# EAGLE design breakout mcp2200 (EAGLE 5.10)
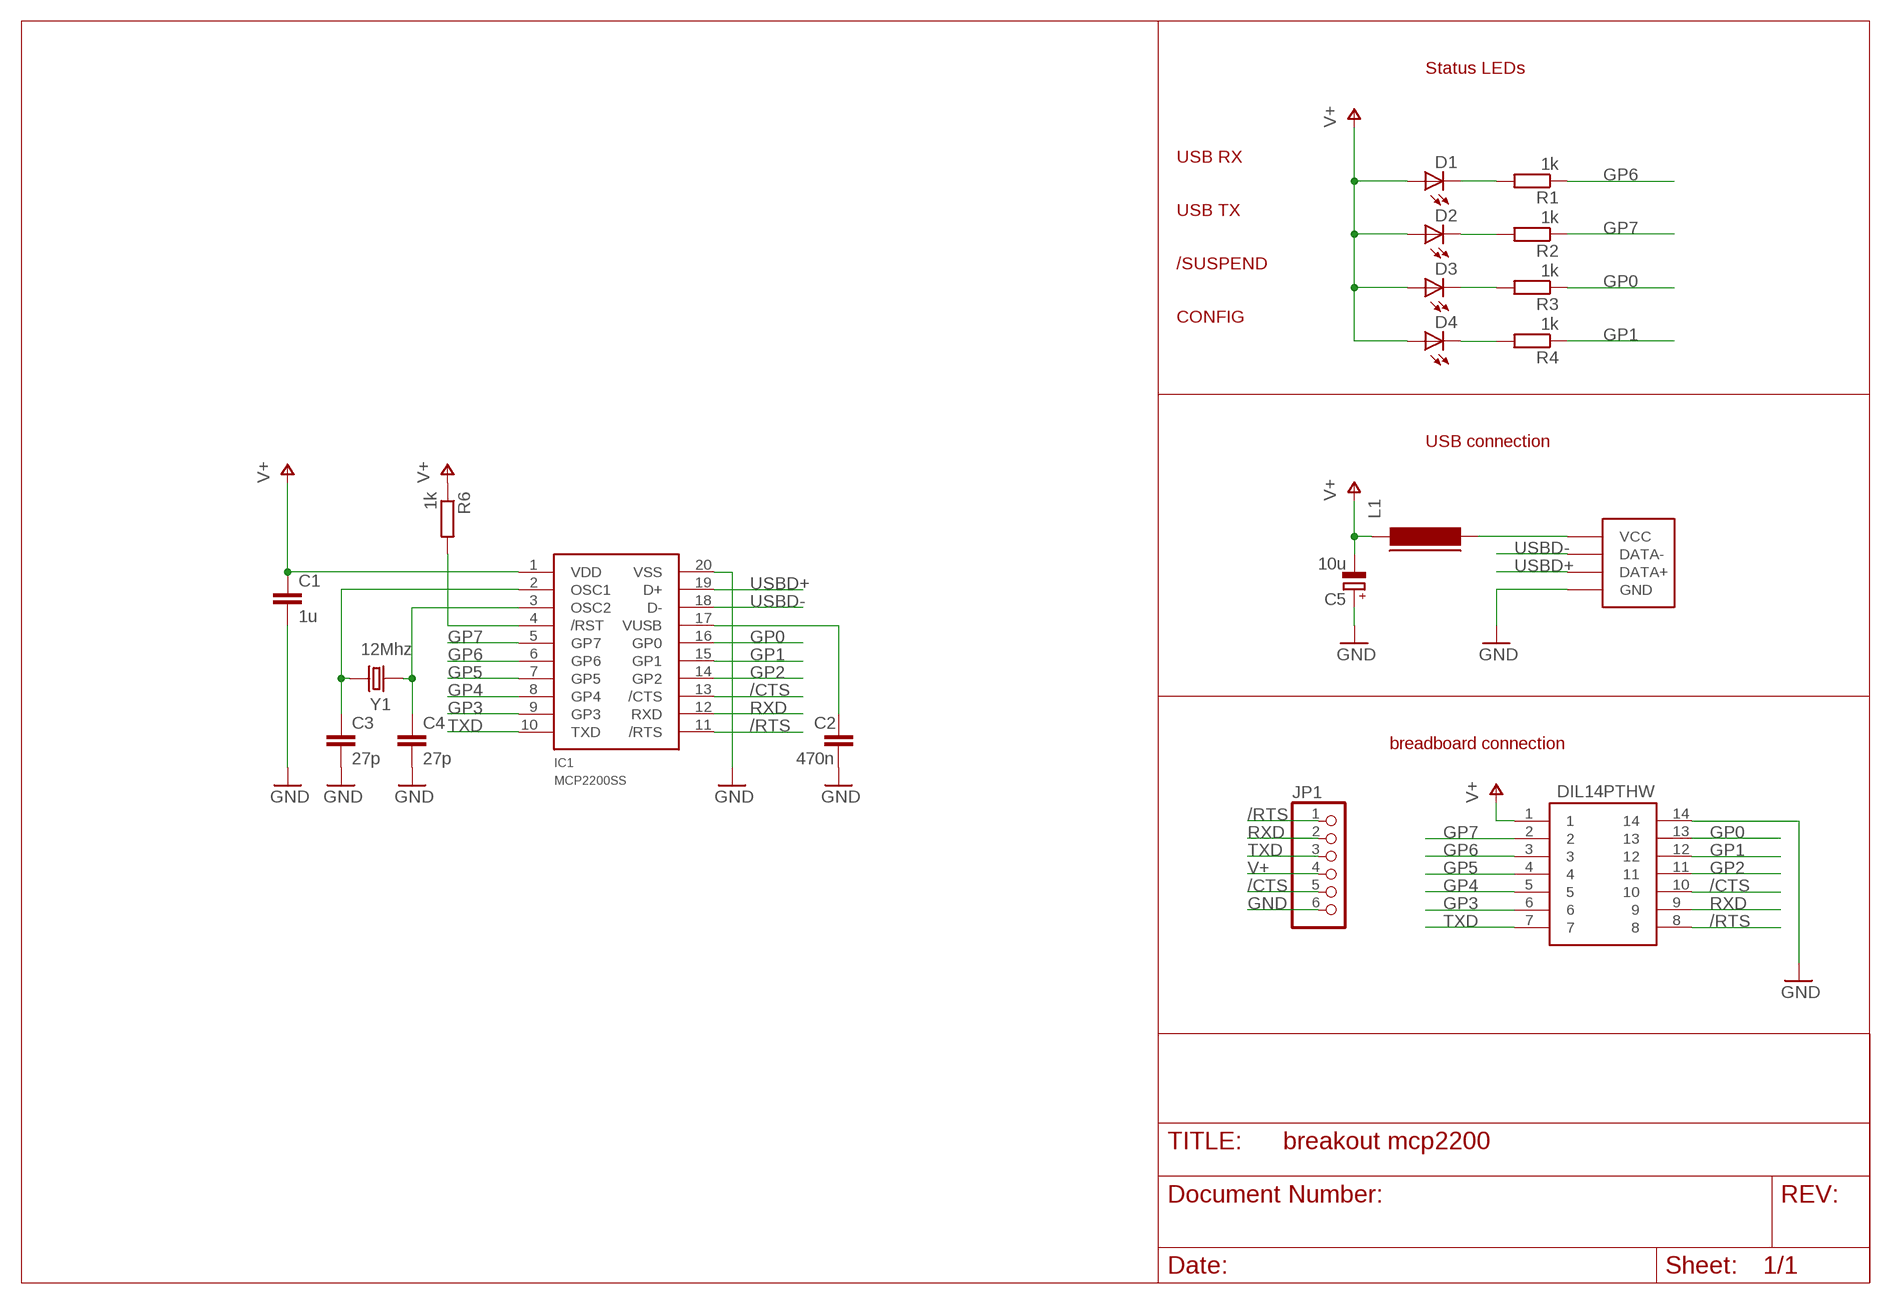
[diagram p0: schematic, sheet 1]

## Parts
C1  1u  CAPC805  [C805]
C2  470n  CAPC805  [C805]
C3  27p  CAPC805  [C805]
C4  27p  CAPC805  [C805]
C5  10u  CAP_POLSMC_A  [SMC_A]
D1  LED805  [LED-805]
D2  LED805  [LED-805]
D3  LED805  [LED-805]
D4  LED805  [LED-805]
IC1  MCP2200SS  [SSOP20]
JP1  PINHD-1X6  [1X06]
L1  FERRITE_BEAD805  [FB805]
R1  1k  RESISTORR805R805  [R805]
R2  1k  RESISTORR805R805  [R805]
R3  1k  RESISTORR805R805  [R805]
R4  1k  RESISTORR805R805  [R805]
R6  1k  RESISTORR805R805  [R805]
U$1  DIL14PTHW  [DIP14W]
X1  MINI-USBUSB2  [CONN_MINI_USB_B]
Y1  12Mhz  CRYSTAL_212M_  [4X6]

## Nets
/CTS: IC1.13(/CTS) JP1.5 U$1.10
/RTS: IC1.11(/RTS) JP1.1 U$1.8
GND: C1.2 C2.2 C3.2 C4.2 C5.+ IC1.20(VSS) JP1.6 U$1.14 X1.GND
GP0: IC1.16(GP0) R3.1 U$1.13
GP1: IC1.15(GP1) R4.1 U$1.12
GP2: IC1.14(GP2) U$1.11
GP3: IC1.9(GP3) U$1.6
GP4: IC1.8(GP4) U$1.5
GP5: IC1.7(GP5) U$1.4
GP6: IC1.6(GP6) R1.1 U$1.3
GP7: IC1.5(GP7) R2.1 U$1.2
N$1: D3.C R3.2
N$2: D1.C R1.2
N$3: D2.C R2.2
N$4: D4.C R4.2
N$5: L1.2 X1.VUSB(VCC)
N$18: C2.1 IC1.17(VUSB)
N$20: C3.1 IC1.2(OSC1) Y1.2(X2)
N$22: C4.1 IC1.3(OSC2) Y1.1(X1)
N$23: IC1.4(/RST) R6.2
RXD: IC1.12(RXD) JP1.2 U$1.9
TXD: IC1.10(TXD) JP1.3 U$1.7
USBD+: IC1.19(D+) X1.D+(DATA+)
USBD-: IC1.18(D-) X1.D-(DATA-)
V+: C1.1 C5.- D1.A D2.A D3.A D4.A IC1.1(VDD) JP1.4 L1.1 R6.1 U$1.1

## Notes on the sheet
- Status LEDs
- USB RX
- USB TX
- /SUSPEND
- CONFIG
- USB connection
- breadboard connection

## Library data of the parts
C1-C4 = dp_devices:CAP
C5 = dp_devices:CAP_POL
D1-D4 = dp_devices:LED
IC1 = dp_devices:MCP2200
JP1 = pinhead - Copy:PINHD-1X6: PIN HEADER
L1 = dp_devices:FERRITE_BEAD
R1-R4 R6 = dp_devices:RESISTOR
U$1 = dp_devices:DIL14
X1 = dp_devices:MINI-USB
Y1 = dp_devices:CRYSTAL_2

## Board
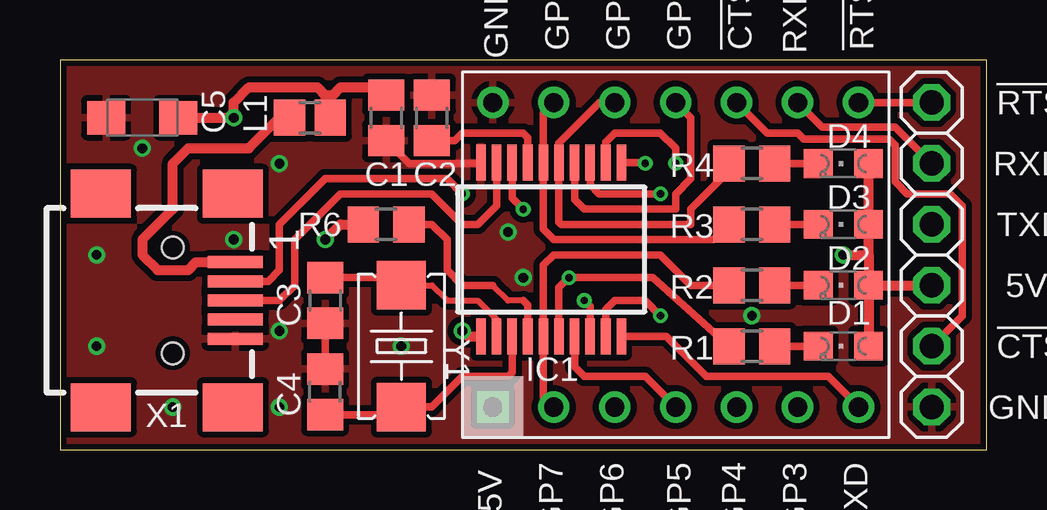
[diagram p1: board, top side]
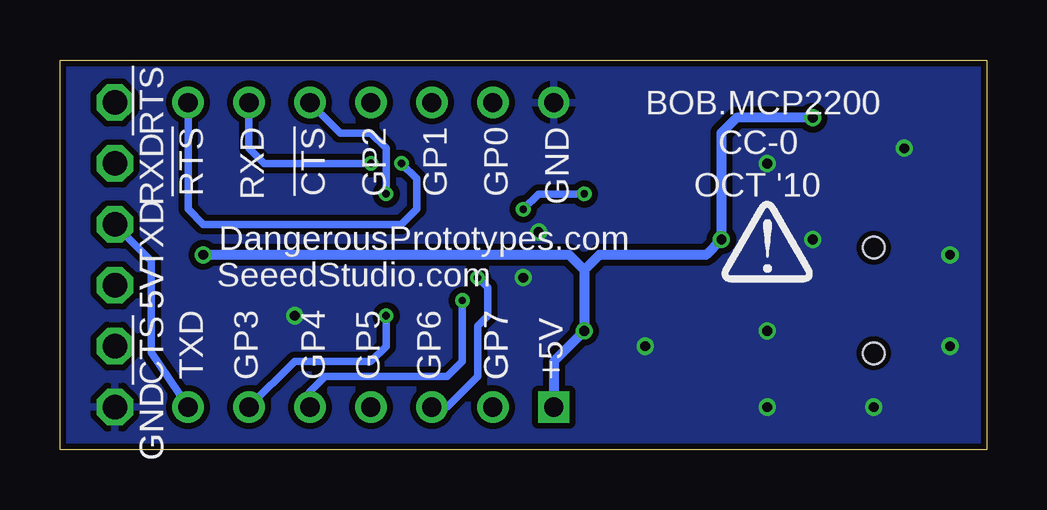
[diagram p2: board, bottom side, seen from below]

Size 38.61 x 16.26 mm. Coordinates in mm from the lower left corner, seen from the top.
Outline: 0,0 38.61,0 38.61,16.26 0,16.26 0,0
Copper layers (1*16): Top 0.035mm / dielectric 1.5mm / Bottom 0.035mm
Design rules "Fusion_eagle_rule_v1.1": minimum track width 6mil, minimum drill 12mil, track to track 6mil, track to pad 6mil, pad to pad 6mil, via to via 6mil, smd to smd 0mil, copper to edge 10mil, drill to drill 10mil, minimum pad ring 10mil, minimum via ring 6mil, stop-mask expansion 2mil, vias tented up to drill 100mil, thermal gap 10mil

### Footprints (pad centres in the part's own frame; a part is rotated, then mirrored left to right if it is on the bottom)
C805 = smd 1.3 x 1.5: 1 -0.95,0; 2 0.95,0
SMC_A = smd 1.6 x 1.4: + -1.5,0; - 1.5,0
LED-805 = smd 1.2 x 1.2: A 0,-1.05; C 0,1.05
SSOP20 = smd 0.4 x 1.5: 1 -2.925,-3.625; 2 -2.275,-3.625; 3 -1.625,-3.625; 4 -0.975,-3.625; 5 -0.325,-3.625; 6 0.325,-3.625; 7 0.975,-3.625; 8 1.625,-3.625; 9 2.275,-3.625; 10 2.925,-3.625; 11 2.925,3.625; 12 2.275,3.625; 13 1.625,3.625; 14 0.975,3.625; 15 0.325,3.625; 16 -0.325,3.625; 17 -0.975,3.625; 18 -1.625,3.625; 19 -2.275,3.625; 20 -2.925,3.625
1X06 = drill 1.016 octagon: 1 -6.35,0; 2 -3.81,0; 3 -1.27,0; 4 1.27,0; 5 3.81,0; 6 6.35,0
FB805 = smd 1.3 x 1.5: 1 -0.85,0; 2 0.85,0
R805 = smd 1.3 x 1.5: 1 -0.95,0; 2 0.95,0
DIP14W = drill 0.8 square: 1 -7.62,-6.35 | drill 0.8 round: 2 -5.08,-6.35; 3 -2.54,-6.35; 4 0,-6.35; 5 2.54,-6.35; 6 5.08,-6.35; 7 7.62,-6.35; 8 7.62,6.35; 9 5.08,6.35; 10 2.54,6.35; 11 0,6.35; 12 -2.54,6.35; 13 -5.08,6.35; 14 -7.62,6.35
CONN_MINI_USB_B = smd 0.5 x 2.3: D+ 0,1.33; D- -0.8,1.33; GND 1.6,1.33; P4 0.8,1.33; VUSB -1.6,1.33 | smd 2 x 2.5: PC1 -4.45,1.23; PC2 4.45,1.23; PC3 4.45,-4.27; PC4 -4.45,-4.27 | hole 0.9: -2.2,-1.27; 2.2,-1.27
4X6 = smd 2.032 x 2.032: 1 -2.54,0; 2 2.54,0

### Placement (x,y rotation side)
C1  13.59,13.84 270 top
C2  15.49,13.84 90 top
C3  11.05,6.22 270 top
C4  11.05,2.41 90 top
C5  3.43,13.84 0 top
D1  32.64,4.32 90 top
D2  32.64,6.86 90 top
D3  32.64,9.4 90 top
D4  32.64,11.94 90 top
IC1  20.46,8.35 0 top
JP1  36.32,8.13 270 top
L1  10.41,13.84 180 top
R1  28.83,4.32 0 top
R2  28.83,6.86 0 top
R3  28.83,9.4 0 top
R4  28.83,11.94 0 top
R6  13.59,9.4 0 top
U$1  25.65,8.13 0 top
U$2  [DP_LOGO]  9.14,7.62 0 bottom
X1  5.97,6.22 270 top
Y1  14.22,4.32 90 top

### Tracks (layer width: path | path; a pad name or v marks a point on that pad's centre or on a via)
/CTS  (via drill 0.3)
  Top 0.305: IC1.13 22.09,11.06 22.48,10.67 v25.02,10.67 | JP1.5 37.59,5.59 37.59,10.16 37.08,10.67 35.31,10.67 34.8,11.18 34.8,12.7 34.54,12.95 30.99,12.95 30.73,13.21 29.46,13.21 U$1.10
  Bottom 0.305: U$1.10 26.92,13.21 25.65,13.21 25.02,12.57 v25.02,10.67
/RTS  (via drill 0.3)
  Top 0.305: IC1.11 24.35,11.97 v24.38,11.94 | U$1.8 JP1.1
  Bottom 0.305: U$1.8 33.27,10.03 32.64,9.4 24.38,9.4 23.75,10.03 23.75,11.3 v24.38,11.94
GND  (via drill 0.41)
  Top 0.305: C4.2 C3.2 | IC1.20 17.4,11.97 17.4,11.94 14.54,11.94 C1.2
  other vias: 14.22,4.32 1.52,4.32 9.14,1.78 19.3,7.18 7.24,8.76 9.14,4.95 1.52,8.13 18.67,9.08 3.43,12.57 9.14,11.94 4.7,1.78 28.83,5.59
  pour Bottom (isolate 0.254): 0,16.26 0,0 38.35,0 38.35,16.26
  pour Top (isolate 0.254): 0,16.26 0,0 38.35,0 38.35,16.26
GP0
  Top 0.305: U$1.13 20.14,14.04 IC1.16 20.14,9.2 20.57,8.76 27.24,8.76 R3.1
GP1
  Top 0.305: U$1.12 22.48,14.48 20.79,12.79 IC1.15 20.79,9.5 20.89,9.4 26.29,9.4 26.29,10.03 27.56,11.3 27.56,11.62 R4.1
GP2
  Top 0.305: IC1.14 21.44,10.44 21.84,10.03 25.65,10.03 25.65,10.67 26.29,11.3 26.29,13.84 U$1.11
GP3  (via drill 0.3)
  Top 0.305: IC1.9 22.74,5.85 23.11,6.22 24.38,6.22 v25.02,5.59
  Bottom 0.305: U$1.6 28.83,3.68 25.65,3.68 25.02,4.32 v25.02,5.59
GP4  (via drill 0.3)
  Top 0.305: IC1.8 22.09,5.98 v21.84,6.22
  Bottom 0.305: U$1.5 28.19,2.41 27.56,3.05 22.48,3.05 21.84,3.68 v21.84,6.22
GP5
  Top 0.305: IC1.7 21.44,3.45 21.84,3.05 24.38,3.05 U$1.4
GP6  (via drill 0.3)
  Top 0.305: IC1.6 20.79,6.76 v21.21,7.18 24.7,7.18 R1.1
  Bottom 0.305: U$1.3 22.48,1.78 21.21,3.05 21.21,5.17 20.79,5.59 20.79,6.76 v21.21,7.18
GP7
  Top 0.305: U$1.2 20.14,2.21 IC1.5 20.14,7.69 20.57,8.13 25.02,8.13 26.29,6.86 R2.1
N$1
  Top 0.305: R3.2 D3.C
N$2
  Top 0.305: R1.2 D1.C
N$3
  Top 0.305: R2.2 D2.C
N$4
  Top 0.305: R4.2 D4.C
N$5
  Top 0.406: X1.VUSB 5.66,7.82 5.33,7.49 4.06,7.49 3.43,8.13 3.43,8.76 4.7,10.03 4.7,11.94 5.33,12.57 7.87,12.57 9.14,13.84 L1.2
N$18
  Top 0.305: IC1.17 19.49,13.02 19.3,13.21 16.76,13.21 16.45,12.89 C2.1
N$20
  Top 0.254: IC1.2 18.19,5.43 17.4,6.22 16.13,6.22 15.49,6.86 Y1.2
  Top 0.305: C3.1 13.91,7.17 Y1.2
N$22
  Top 0.305: C4.1 13.91,1.46 Y1.1 15.49,1.78 16.76,3.05 18.67,3.05 18.84,3.22 IC1.3
N$23
  Top 0.254: 19.3,6.22 18.67,6.22 18.03,6.86
  Top 0.305: IC1.4 19.49,6.04 19.3,6.22 | R6.2 15.49,9.4 16.13,8.76 16.13,7.49 16.76,6.86 18.03,6.86
RXD  (via drill 0.3)
  Top 0.305: IC1.12 22.74,12.83 23.11,13.21 25.02,13.21 25.65,12.57 v25.65,11.94 | JP1.2 34.8,13.46 31.75,13.46 U$1.9
  Bottom 0.305: U$1.9 30.73,12.57 30.1,11.94 v25.65,11.94
TXD
  Top 0.305: IC1.10 25.25,4.72 26.92,3.05 32,3.05 U$1.7
  Bottom 0.305: JP1.3 34.8,7.87 34.8,4.06 U$1.7
USBD+
  Top 0.305: IC1.19 18.19,10.19 17.4,9.4 16.76,9.4 15.49,10.67 11.68,10.67 9.78,8.76 9.78,6.86 9.14,6.22 X1.D+
USBD-  (via drill 0.3)
  Top 0.305: v16.76,10.67 16.13,11.3 11.05,11.3 | 18.84,10.5 IC1.18 | 18.84,10.5 18.99,10.35 | v19.3,10.03 18.84,10.5 | 11.05,11.3 10.58,10.83 | X1.D- 8.67,7.02 9.14,7.49 9.14,9.4 11.05,11.3
  Bottom 0.305: v16.76,10.67 18.67,10.67 v19.3,10.03
V+  (via drill 0.41)
  Top 0.406: D4.A D3.A 33.69,8.13 | D2.A D1.A | 33.69,8.13 D2.A | 11.05,14.8 10.73,15.11 7.87,15.11 7.24,14.48 v7.24,13.84 C5.- | 11.05,14.8 11.05,14.06 L1.1 11.26,14.58 11.05,14.8 | 11.05,14.8 11.37,14.8 11.68,15.11 13.27,15.11 C1.1 | R6.1 11.68,9.4 v11.05,8.76 | IC1.1 17,4.72 v16.76,4.95 | v32.64,8.13 33.69,8.13 | D2.A JP1.4
  Bottom 0.406: 16.76,7.49 v16.76,4.95 18.03,3.68 U$1.1 | 16.76,7.49 16.13,8.13 11.68,8.13 v11.05,8.76 11.05,13.21 10.41,13.84 v7.24,13.84 | v32.64,8.13 17.4,8.13 16.76,7.49

### Text on the board
tNames: GND | GP0 | GP1 | GP2 | !CTS | RXD | !RTS | !RTS | RXD | TXD | 5V | !CTS | GND | +5V | GP7 | GP6 | GP5 | GP4 | GP3 | TXD
bNames: !RTS | BOB.MCP2200 | GND | GP0 | GP1 | GP2 | !CTS | RXD | !RTS | RXD | CC-0 | OCT '10 | TXD | DangerousPrototypes.com | 5V | 5V | SeeedStudio.com | !CTS | +5V | GP7 | GP7 | GP6 | GP5 | GP4 | GP3 | TXD | GND | GND
_tsilk: CvD | V+